# Altium schematic sheet SAMV71_Xplained_Ultra_Power_Converter.SchDoc: Power Converter
size A3; Organization: ATMEL Norway; Address1: Vestre Rosten 79; Address2: N-7075 TILLER; Address3: NORWAY; DocumentNumber: A09-2407; Revision: 3; SheetNumber: 4; SheetTotal: 13; PageSetup: Record=PageOptions|CenterHorizontal=True|CenterVertical=True|PrintScale=1.01|XCorrection=1.00|YCorrection=1.00|PrintKind=1|BorderSize=5000000|LeftOffset=0|BottomOffset=0|Orientation=2|PaperLength=1000|PaperWidth=1000|Scale=100|PaperSource=7|PrintQuality=-4|MediaType=1|DitherType=10|PaperKind=A3 (297 x 420 mm)|PrintScaleMode=1
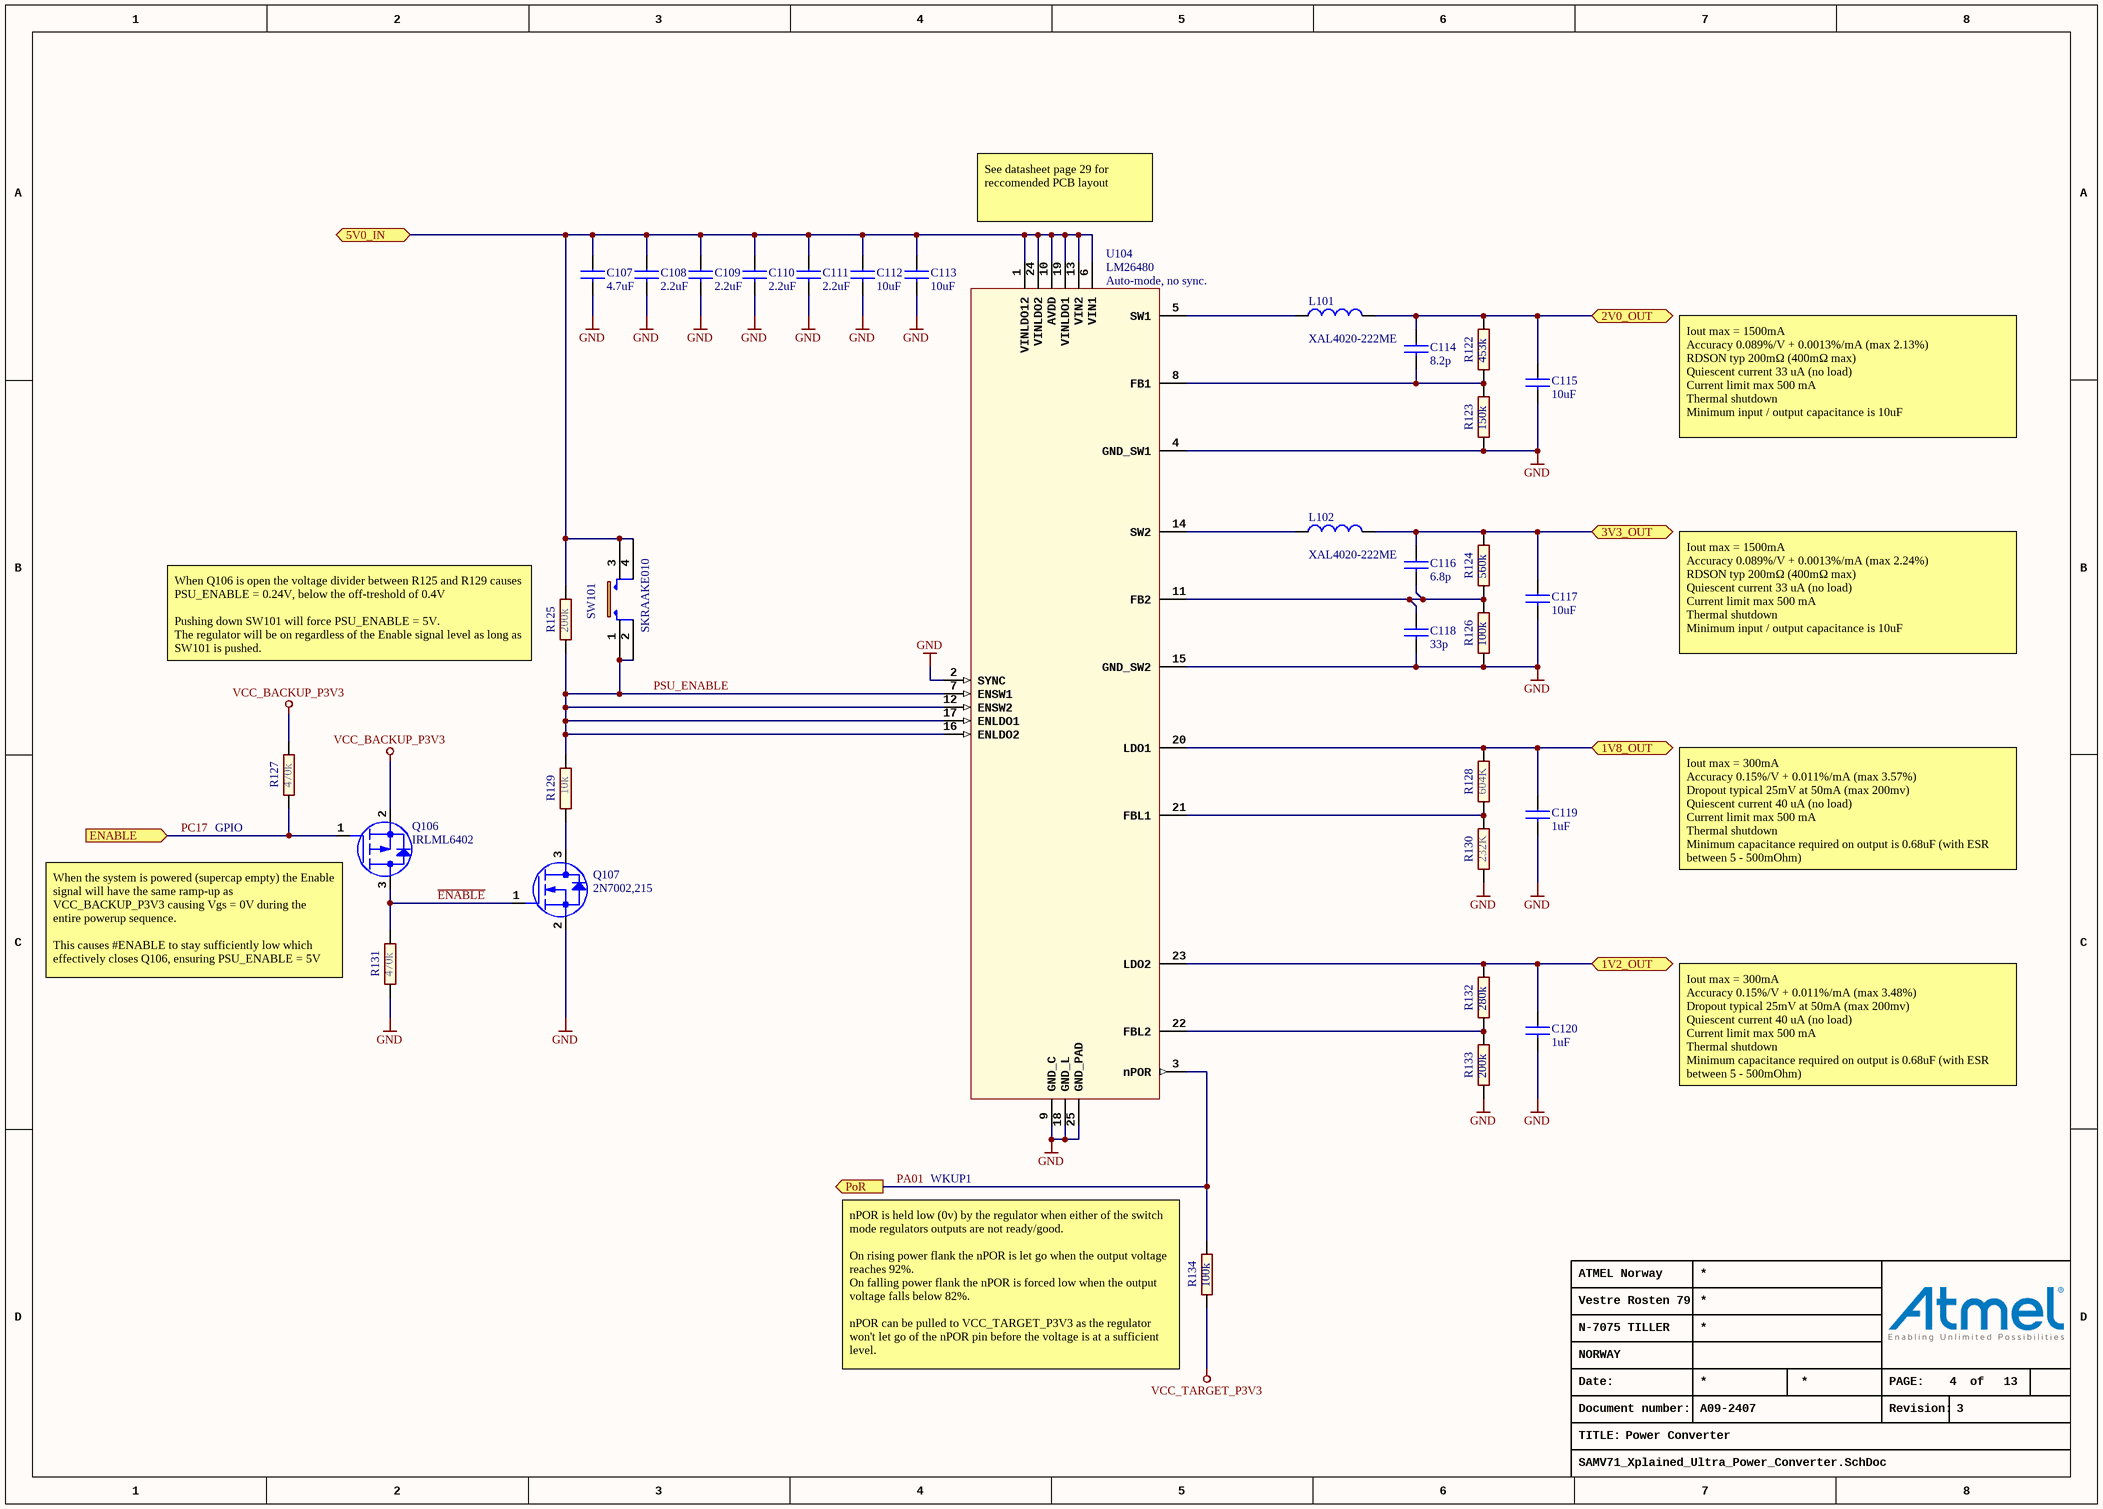
[diagram p0: SAMV71_Xplained_Ultra_Power_Converter.SchDoc]

## Parts
C107  value 4.7uF  [AP1-00039]
C108  value 2.2uF  [AP1-00053]  (hidden comment: Farnell no: 1288200)
C109  value 2.2uF  [AP1-00053]  (hidden comment: Farnell no: 1288200)
C110  value 2.2uF  [AP1-00053]  (hidden comment: Farnell no: 1288200)
C111  value 2.2uF  [AP1-00053]  (hidden comment: Farnell no: 1288200)
C112  value 10uF  [AP1-00041]
C113  value 10uF  [AP1-00041]
C114  value 8.2p  [AP1-00053]
C115  value 10uF  [AP1-00041]
C116  value 6.8p  [AP1-00053]
C117  value 10uF  [AP1-00041]
C118  value 33p  [AP1-00053]
C119  value 1uF  [AP1-00053]
C120  value 1uF  [AP1-00053]
L101  value XAL4020-222ME  [AP3-00119]
L102  value XAL4020-222ME  [AP3-00119]
Q106  value IRLML6402  [AP5-00002]
Q107  value 2N7002,215  [AP5-00002]
R122  value 453k  [AP2-00011]
R123  value 150k  [AP2-00011]
R124  value 560k  [AP2-00011]
R125  value 200k  [AP2-00011]
R126  value 100k  [AP2-00011]
R127  value 470k  [AP2-00011]
R128  value 604K  [AP2-00011]
R129  value 10k  [AP2-00011]
R130  value 232K  [AP2-00011]
R131  value 470k  [AP2-00011]
R132  value 280k  [AP2-00011]
R133  value 200k  [AP2-00011]
R134  value 100k  [AP2-00011]
SW101  value SKRAAKE010  [AP8-00137]  (hidden comment: Can be ordered in low volumes from Mouser)
U104  Auto-mode, no sync.  value LM26480  [AP6-00380]

## Ports
1V2_OUT, 1V8_OUT, 2V0_OUT (bidir), 3V3_OUT, 5V0_IN, ENABLE (in), PoR (out)

## Nets
GND: C107.2 C108.2 C109.2 C110.2 C111.2 C112.2 C113.2 C115.2 C117.2 C118.2 C119.2 C120.2 Q107.2(S) R123.1 R126.2 R130.1 R131.1 R133.1 U104.2(SYNC) U104.4(GND_SW1) U104.9(GND_C) U104.15(GND_SW2) U104.18(GND_L) U104.25(GND_PAD)
VCC_BACKUP_P3V3: Q106.2(S) R127.2
VCC_TARGET_P3V3: R134.2
1V2_OUT: C120.1 R132.2 U104.23(LDO2) ; port 1V2_OUT
1V8_OUT: C119.1 R128.2 U104.20(LDO1) ; port 1V8_OUT
2V0_OUT: C114.1 C115.1 L101.2 R122.2 ; port 2V0_OUT
3V3_OUT: C116.1 C117.1 L102.2 R124.2 ; port 3V3_OUT
5V0_IN: C107.1 C108.1 C109.1 C110.1 C111.1 C112.1 C113.1 R125.2 SW101.3 SW101.4 U104.1(VINLDO12) U104.6(VIN1) U104.10(AVDD) U104.13(VIN2) U104.19(VINLDO1) U104.24(VINLDO2) ; port 5V0_IN
~{ENABLE}: Q106.3(D) Q107.1(G) R131.2
PA01: R134.1 U104.3(nPOR) ; port PoR
PC17: Q106.1(G) R127.1 ; port ENABLE
PSU_ENABLE: R125.1 R129.2 SW101.1 SW101.2 U104.7(ENSW1) U104.12(ENSW2) U104.16(ENLDO2) U104.17(ENLDO1)
NetC114_2: C114.2 R122.1 R123.2 U104.8(FB1)
NetC116_2: C116.2 C118.1 R124.1 R126.1 U104.11(FB2)
NetL101_1: L101.1 U104.5(SW1)
NetL102_1: L102.1 U104.14(SW2)
NetQ107_3: Q107.3(D) R129.1
NetR128_1: R128.1 R130.2 U104.21(FBL1)
NetR132_1: R132.1 R133.2 U104.22(FBL2)

## Notes on the sheet
- See datasheet page 29 for reccomended PCB layout
- Iout max = 1500mA
  Accuracy 0.089%/V + 0.0013%/mA (max 2.13%)
  RDSON typ 200mΩ (400mΩ max)
  Quiescent current 33 uA (no load)
  Current limit max 500 mA
  Thermal shutdown
  Minimum input / output capacitance is 10uF
- Iout max = 1500mA
  Accuracy 0.089%/V + 0.0013%/mA (max 2.24%)
  RDSON typ 200mΩ (400mΩ max)
  Quiescent current 33 uA (no load)
  Current limit max 500 mA
  Thermal shutdown
  Minimum input / output capacitance is 10uF
- (near R125) When Q106 is open the voltage divider between R125 and R129 causes PSU_ENABLE = 0.24V, below the off-treshold of 0.4V
  Pushing down SW101 will force PSU_ENABLE = 5V.
  The regulator will be on regardless of the Enable signal level as long as SW101 is pushed.
- GPIO
- Iout max = 300mA
  Accuracy 0.15%/V + 0.011%/mA (max 3.57%)
  Dropout typical 25mV at 50mA (max 200mv)
  Quiescent current 40 uA (no load)
  Current limit max 500 mA
  Thermal shutdown
  Minimum capacitance required on output is 0.68uF (with ESR between 5 - 500mOhm)
- (near Q106) When the system is powered (supercap empty) the Enable signal will have the same ramp-up as VCC_BACKUP_P3V3 causing Vgs = 0V during the entire powerup sequence.
  This causes #ENABLE to stay sufficiently low which effectively closes Q106, ensuring PSU_ENABLE = 5V
- Iout max = 300mA
  Accuracy 0.15%/V + 0.011%/mA (max 3.48%)
  Dropout typical 25mV at 50mA (max 200mv)
  Quiescent current 40 uA (no load)
  Current limit max 500 mA
  Thermal shutdown
  Minimum capacitance required on output is 0.68uF (with ESR between 5 - 500mOhm)
- WKUP1
- (near R134) nPOR is held low (0v) by the regulator when either of the switch mode regulators outputs are not ready/good.
  On rising power flank the nPOR is let go when the output voltage reaches 92%.
  On falling power flank the nPOR is forced low when the output voltage falls below 82%.
  nPOR can be pulled to VCC_TARGET_P3V3 as the regulator won't let go of the nPOR pin before the voltage is at a sufficient level.
- Date:
- PAGE:
- of
- TITLE:
- Document number:
- Revision:

## Library data of the parts
C107 = A01-0377: Ceramic capacitor, SMD 0603, X5R, 10V, 10% (de31036); PartGroup: Capacitors,Ceramic,SMD 0603; Manufacturer: tdk; MPN: C1608X5R1A475K; TemperatureRange: -55 - +85 deg C; AN: A01-0377; Tolerance: 10%; Height: 0,800000011920929
C108-C111 = A01-0300: Ceramic capacitor, SMD 0402, X5R, 6.3V, +/-20%; PartGroup: Capacitors,Ceramic,SMD 0402; Manufacturer: Kemet; MPN: C0402C225M9PAC; Tolerance: Â±20%; TemperatureRange: -55Â°C to +85Â°C; AN: A01-0300; Height: 0,5
C112 C113 C115 C117 = A01-0360: Ceramic capacitor, SMD 0805, X5R, 10V, 10 %, (de19441); PartGroup: Capacitors,Ceramic,SMD 0805; Manufacturer: Murata; MPN: GRM21BR61A106KE19L; Tolerance: 10%; TemperatureRange: -55 - +85 deg C; AN: A01-0360; Height: 1,25
C114 = A01-0014: Ceramic capacitor, SMD 0402, NP0, 50V, +/-5%; PartGroup: Capacitors,Ceramic,SMD 0402; TemperatureRange: -55 - +125 deg C; AN: A01-0014; Tolerance: 50V, +/-5%; Height: 0,550000011920929
C116 = A01-0013: Ceramic capacitor, SMD 0402, NP0, 50V, +/-5%; PartGroup: Capacitors,Ceramic,SMD 0402; TemperatureRange: -55 - +125 deg C; AN: A01-0013; Tolerance: 50V, +/-5%; Height: 0,550000011920929
C118 = A01-0021: Ceramic capacitor, SMD 0402, NP0, 50V, +/-5%; PartGroup: Capacitors,Ceramic,SMD 0402; TemperatureRange: -55 - +125 deg C; AN: A01-0021; Tolerance: 50V, +/-5%; Height: 0,550000011920929
C119 C120 = A01-0447: Ceramic capacitor, SMD 0402, X5R, 10V, ±10 %; PartGroup: Capacitors,Ceramic,SMD 0402; Manufacturer: AVX; MPN: 0402ZD105KAT2A; AN: A01-0447; Height: 0,560000002384186
L101 L102 = A03-0197: 2.2ÂµH Shielded Power Inductor, 4x4x2mm, Isat=5.6A , Irms=4.0A , DCR=35.2mÎ©; PartGroup: Inductors,Power Inductors; Manufacturer: Coilcraft; MPN: XAL4020-222MEC; Tolerance: 20%; TemperatureRange: â€“40Â°C to +125Â°C; AN: A03-0197; Height: 2
Q106 = A05-0087: P-ch. MOSFET. -30V, -3.7A continuous,RDS(ON)=0.05Ohm@VGS=-4,5V, RDS(ON)=0.08Ohm@VGS=-2.5V; PartGroup: Transistors,Power FET,SMD; Manufacturer: International Rectifier; MPN: IRLML6402PBF; TemperatureRange: -55 - +150 deg C; AN: A05-0087; Height: 1,14999997615814
Q107 = A05-0085: N-Channel MOSFET. 60V, 0.300A continuous, 1.2A Peak. RDS(ON) = 3.8Ohm@VGS=4.5V, VGS(th)<2.5V; PartGroup: Transistors,Small signal FET,SMD; Manufacturer: NXP; TemperatureRange: -65 to 150 deg C; AN: A05-0085; Height: 1,10000002384186; MPN: 2N7002,215
R122 = A02-0925: Thick film resistor, SMD 0402, 1/16W, 1%; PartGroup: Resistors,SMD,0402 1%; TemperatureRange: -55 - +125 deg C; AN: A02-0925; Tolerance: 1 %; Height: 0,349999994039536
R123 = A02-0264: Thick film resistor, SMD 0402, 1/16W, 1%; PartGroup: Resistors,SMD,0402 1%; TemperatureRange: -55 - +125 deg C; AN: A02-0264; Tolerance: 1 %; Height: 0,349999994039536
R124 = A02-0278: Thick film resistor, SMD 0402, 1/16W, 1%; PartGroup: Resistors,SMD,0402 1%; TemperatureRange: -55 - +125 deg C; AN: A02-0278; Tolerance: 1 %; Height: 0,349999994039536
R125 R133 = A02-0267: Thick film resistor, SMD 0402, 1/16W, 1%; PartGroup: Resistors,SMD,0402 1%; TemperatureRange: -55 - +125 deg C; AN: A02-0267; Tolerance: 1 %; Height: 0,349999994039536
R126 R134 = A02-0260: Thick film resistor, SMD 0402, 1/16W, 1%; PartGroup: Resistors,SMD,0402 1%; TemperatureRange: -55ï¿½ to +125ï¿½C; AN: A02-0260; Tolerance: 1 %; Height: 0,349999994039536
R127 R131 = A02-0276: Thick film resistor, SMD 0402, 1/16W, 1%; PartGroup: Resistors,SMD,0402 1%; TemperatureRange: -55 - +125 deg C; AN: A02-0276; Tolerance: 1 %; Height: 0,349999994039536
R128 = A02-0923: Thick film resistor, SMD 0402, 1/16W, 1%; PartGroup: Resistors,SMD,0402 1%; TemperatureRange: -55 - +125 deg C; AN: A02-0923; Tolerance: 1 %; Height: 0,349999994039536
R129 = A02-0236: Thick film resistor, SMD 0402, 1/16W, 1%; PartGroup: Resistors,SMD,0402 1%; Manufacturer: vishay; MPN: CRCW040210K0FKED; TemperatureRange: -55 - +125 deg C; AN: A02-0236; Tolerance: 1 %; Height: 0,349999994039536
R130 = A02-0927: Thick film resistor, SMD 0402, 1/16W, 1%; PartGroup: Resistors,SMD,0402 1%; TemperatureRange: -55Â°C to +150Â°C; AN: A02-0927; Height: 0,349999994039536; Tolerance: 1 %
R132 = A02-0924: Thick film resistor, SMD 0402, 1/16W, 1%; PartGroup: Resistors,SMD,0402 1%; TemperatureRange: -55 - +125 deg C; AN: A02-0924; Tolerance: 1 %; Height: 0,349999994039536
SW101 = A08-0790: 6.2x6.2 mm SMD tact switch, same as A08-0091 but less force is needed; PartGroup: Mechanical devices,Switches,SMD; Manufacturer: ALPS; TemperatureRange: -30 - +90 deg C; AN: A08-0790; Height: 5,09999990463257; MPN: SKRAAKE010
U104 = A06-1165: Externally Programmable Dual High-Current Step-Down DC/DC and Dual Linear Regulators; PartGroup: Integrated Circuits,Regulators,Switched; Manufacturer: Texas Instruments; MPN: LM26480SQ-AA/NOPB; TemperatureRange: -40C to 85C; AN: A06-1165; Height: 0,800000011920929